# EAGLE design masterPuck (EAGLE 8.6.0)
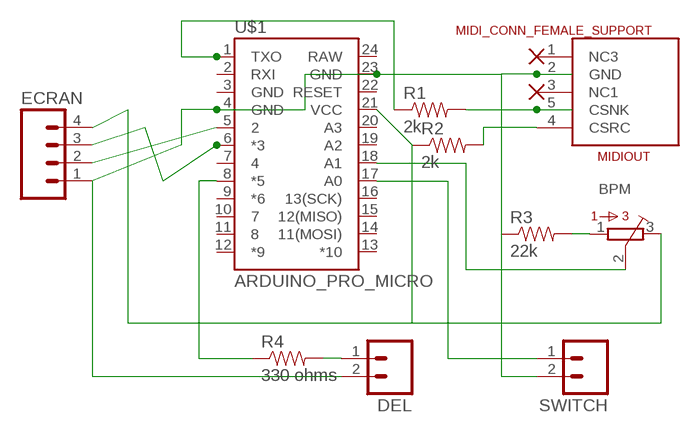
[diagram p0: schematic, sheet 1]

## Parts
BPM  3386-P  [3386P]
DEL  M02LOCK  [1X02_LOCK]
ECRAN  M04PTH  [1X04]
MIDIOUT  MIDI_CONN_FEMALE_SUPPORT  [DIN_5_FEMALE_SUPPORT]
R1  2k  RESISTOR1206  [1206]
R2  2k  RESISTOR1206  [1206]
R3  22k  RESISTOR1206  [1206]
R4  330 ohms  RESISTOR1206  [1206]
SWITCH  M02LOCK  [1X02_LOCK]
U$1  ARDUINO_PRO_MICRO  [ARDUINO_PRO_MICRO]

## Nets
GND: DEL.2 ECRAN.1 MIDIOUT.2(GND) R3.1 SWITCH.2 U$1.4(GND) U$1.23(GND)
N$2: MIDIOUT.5(CSNK) R1.2
N$3: MIDIOUT.4(CSRC) R2.2
N$5: R1.1 U$1.1(TXO)
N$7: ECRAN.2 U$1.5
N$8: ECRAN.3 U$1.6(*3)
N$9: BPM.1 R3.2
N$10: BPM.2 U$1.18(A1)
N$11: DEL.1 R4.2
N$12: R4.1 U$1.8(*5)
N$13: SWITCH.1 U$1.17(A0)
VCC: BPM.3 ECRAN.4 R2.1 U$1.21(VCC)
Unconnected: MIDIOUT.1(NC3) MIDIOUT.3(NC1) U$1.2(RXI) U$1.3(GND) U$1.7 U$1.9(*6) U$1.10 U$1.11 U$1.12(*9) U$1.13(*10) U$1.14(11(MOSI)) U$1.15(12(MISO)) U$1.16(13(SCK)) U$1.19(A2) U$1.20(A3) U$1.22(RESET) U$1.24(RAW)

## Library data of the parts
BPM = bourns.rpt:3386-: 3386 Series 3/8" Square Trimmer
DEL SWITCH = SparkFun-Connectors:M02: Standard 2-pin 0.1" header. Use with - straight break away headers ( PRT-00116) - right angle break away headers (PRT-00553) - swiss pins (PRT-00743) - machine pins (PRT-00117) - female headers (PRT-00115) Molex polarized connector foot print use with: PRT-08233 with associated crimp pins and housings. 2.54_SCREWTERM for use with PRT-10571. 3.5mm Screw Terminal footprints for PRT-08084 5mm Screw Terminal footprints for use with PRT-08432
ECRAN = SparkFun-Connectors:M04: Header 4 Standard 4-pin 0.1" header. Use with straight break away headers (SKU : PRT-00116), right angle break away headers (PRT-00553), swiss pins (PRT-00743), machine pins (PRT-00117), and female headers (PRT-00115). Molex polarized connector foot print use with SKU : PRT-08231 with associated crimp pins and housings. 1MM SMD Version SKU: PRT-10208
MIDIOUT = SparkFun-Connectors:MIDI_CONN_FEMALE_SUPPORT: MIDI connector with strain relief (DIN-5 female)
R1-R4 = SparkFun-Passives:RESISTOR: Resistor Basic schematic elements and footprints for 0603, 1206, and PTH resistors.
U$1 = SparkFun-Boards:ARDUINO_PRO_MICRO

## Board
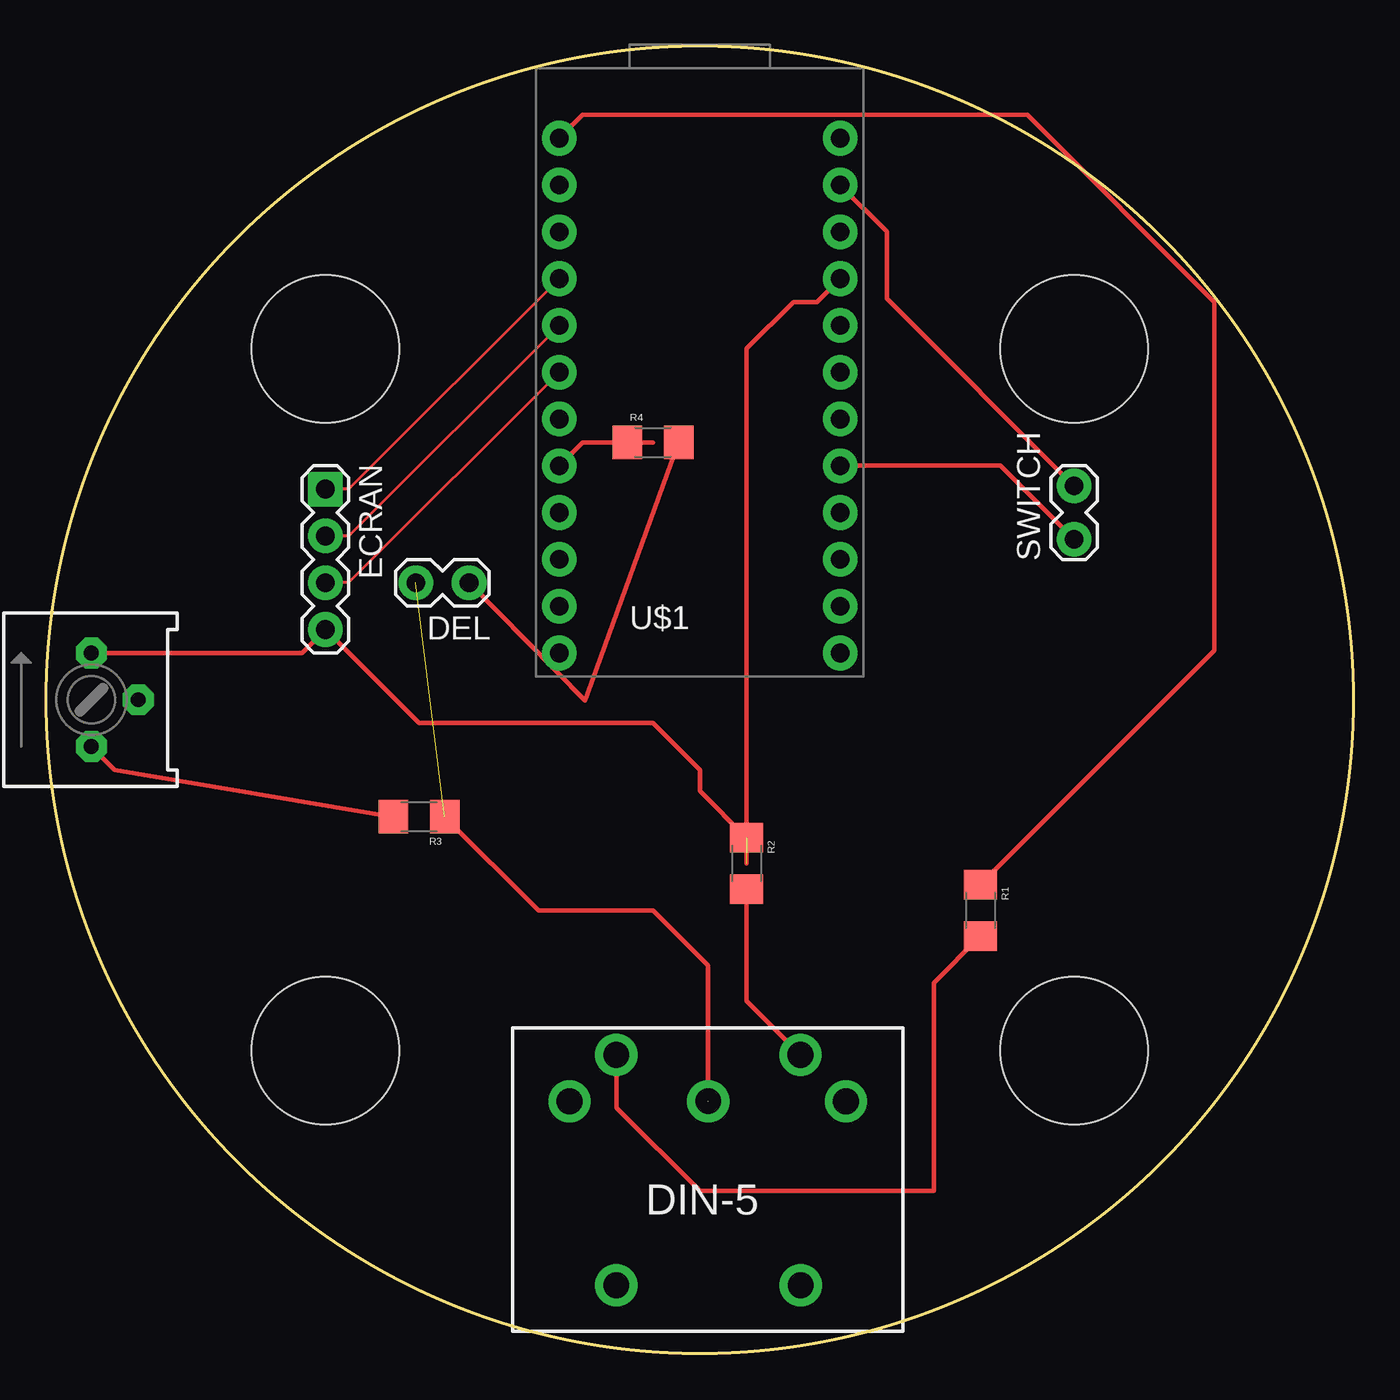
[diagram p1: board, top side]
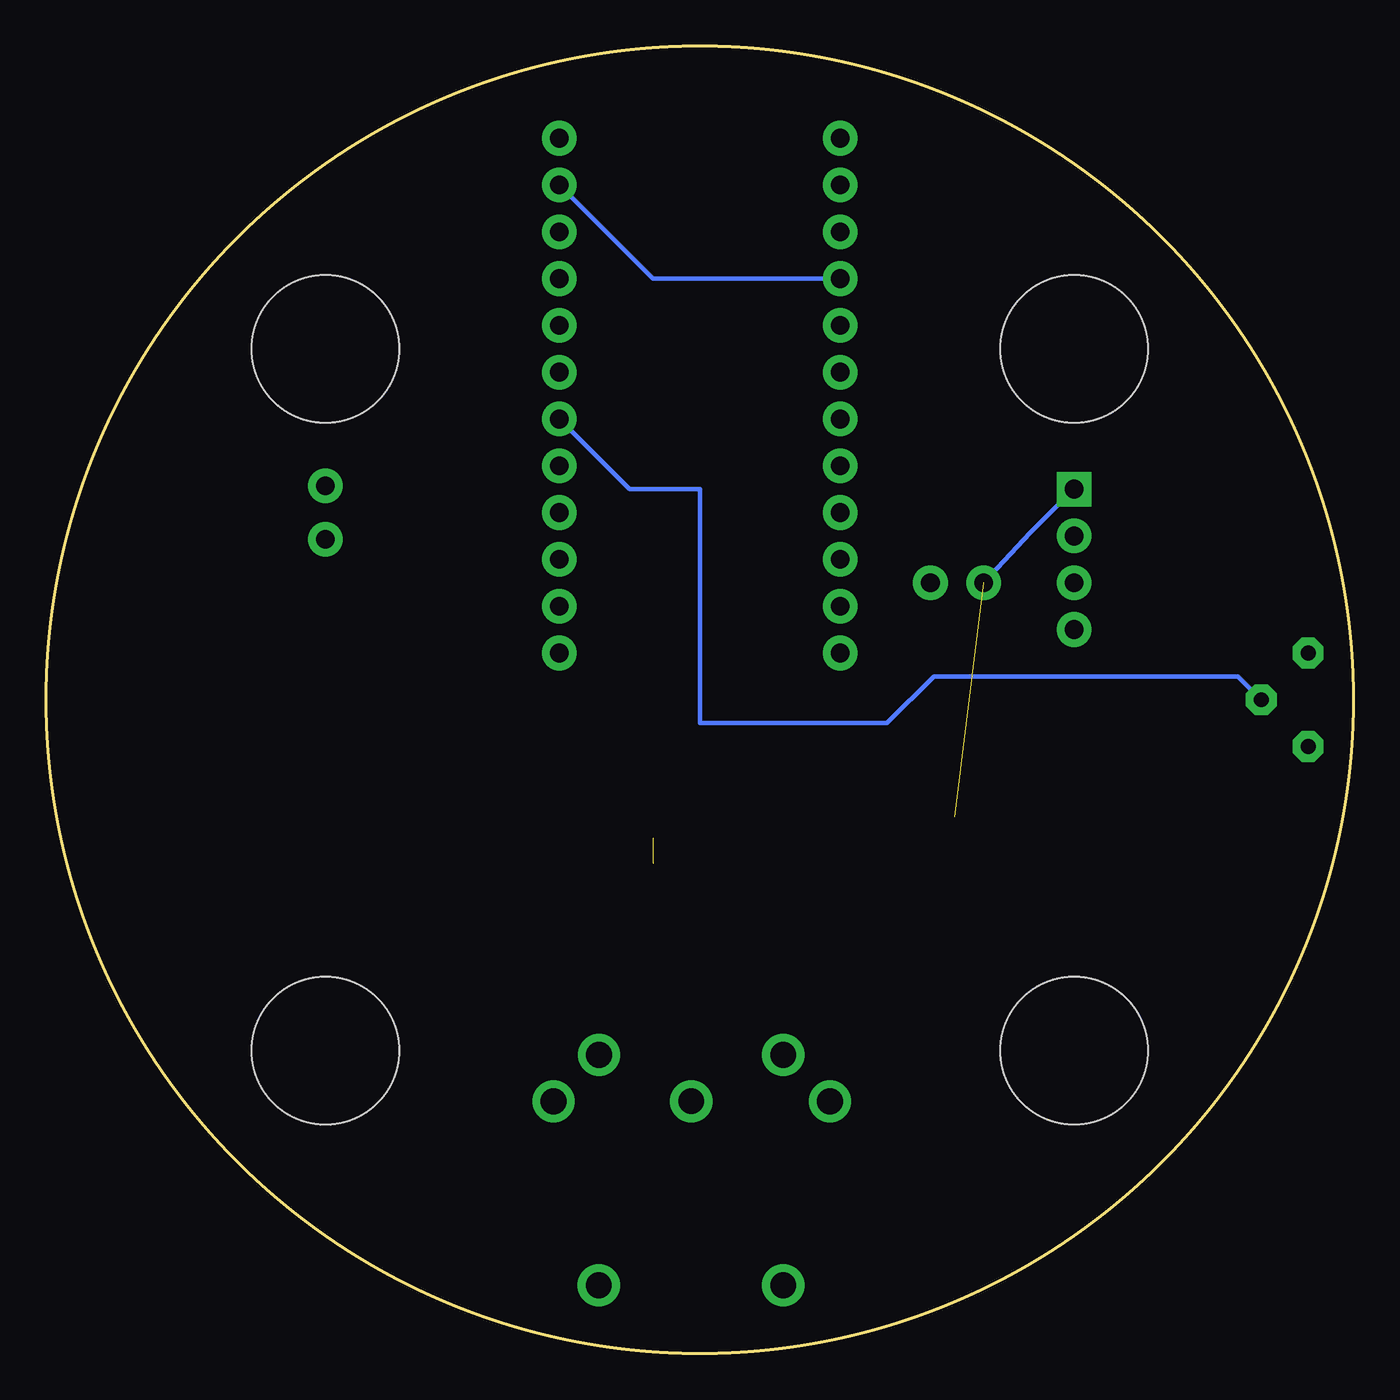
[diagram p2: board, bottom side, seen from below]

Size 70.97 x 70.97 mm. Coordinates in mm from the lower left corner, seen from the top.
Outline: circle at 35.48,35.48 radius 35.48
Copper layers (1*16): Top 0.035mm / dielectric 1.5mm / Bottom 0.035mm
Design rules "default": minimum track width 6mil, minimum drill 0.35mm, track to track 6mil, track to pad 6mil, pad to pad 6mil, via to via 6mil, smd to smd 6mil, copper to edge 40mil, drill to drill 6mil, minimum pad ring 10mil, minimum via ring 8mil, stop-mask expansion 4mil, vias tented up to drill 0mil, thermal gap 10mil
Holes 8 mm at 15.16,54.53 15.16,16.43 55.8,54.53 55.8,16.43

### Footprints (pad centres in the part's own frame; a part is rotated, then mirrored left to right if it is on the bottom)
3386P = drill 0.813 pad 1.676 octagon: 1 -2.54,0; 2 0,-2.54; 3 2.54,0
1X02_LOCK = drill 1.016 pad 1.88: 1 -0.178,0; 2 2.718,0
1X04 = drill 1.016 pad 1.88 square: 1 0,0 | drill 1.016 pad 1.88: 2 2.54,0; 3 5.08,0; 4 7.62,0
DIN_5_FEMALE_SUPPORT = drill 1.4 pad 2.286: 1 7.94,3.6; 2 0.46,3.61; 3 -7.07,3.6; 4 5.47,6.13; 5 -4.53,6.12; 6 -4.53,-6.382; 7 5.478,-6.382
1206 = smd 1.6 x 1.8: 1 -1.4,0; 2 1.4,0
ARDUINO_PRO_MICRO = drill 1.016 pad 1.88: 1 -7.62,12.7; 2 -7.62,10.16; 3 -7.62,7.62; 4 -7.62,5.08; 5 -7.62,2.54; 6 -7.62,0; 7 -7.62,-2.54; 8 -7.62,-5.08; 9 -7.62,-7.62; 10 -7.62,-10.16; 11 -7.62,-12.7; 12 -7.62,-15.24; 13 7.62,-15.24; 14 7.62,-12.7; 15 7.62,-10.16; 16 7.62,-7.62; 17 7.62,-5.08; 18 7.62,-2.54; 19 7.62,0; 20 7.62,2.54; 21 7.62,5.08; 22 7.62,7.62; 23 7.62,10.16; 24 7.62,12.7

### Placement (x,y rotation side)
BPM  2.46,35.48 90 top
DEL  22.78,41.83 180 top
ECRAN  15.16,46.91 270 top
MIDIOUT  35.48,10.08 0 top
R1  50.72,24.05 270 top
R2  38.02,26.59 270 top
R3  20.24,29.13 180 top
R4  32.94,49.45 0 top
SWITCH  55.8,44.37 90 top
U$1  35.48,53.26 0 top

### Tracks (layer width: path | path; a pad name or v marks a point on that pad's centre or on a via)
GND  (1 unrouted)
  Top 0.152: U$1.4 16.43,46.91 ECRAN.1
  Top 0.254: SWITCH.2 45.64,57.25 45.64,60.88 U$1.23 | R3.1 26.72,24.05 32.94,24.05 35.94,21.05 MIDIOUT.2
  Bottom 0.254: U$1.23 38.02,58.34 U$1.4 | DEL.2 17.53,44.55 ECRAN.1
N$2
  Top 0.254: MIDIOUT.5 30.95,13.34 35.48,8.81 48.18,8.81 48.18,20.11 R1.2
N$3
  Top 0.254: MIDIOUT.4 38.02,19.14 R2.2
N$5
  Top 0.254: U$1.1 29.13,67.23 53.26,67.23 63.42,57.07 63.42,38.15 R1.1
N$7
  Top 0.152: U$1.5 16.43,44.37 ECRAN.2
N$8
  Top 0.152: U$1.6 16.43,41.83 ECRAN.3
N$9
  Top 0.254: BPM.1 3.73,31.67 R3.2
N$10
  Bottom 0.254: U$1.18 39.29,46.91 35.48,46.91 35.48,34.21 25.32,34.21 22.78,36.75 6.27,36.75 BPM.2
N$11
  Top 0.254: DEL.1 29.26,35.44 R4.2
N$12
  Top 0.254: U$1.8 29.13,49.45 R4.1 32.94,49.45
N$13
  Top 0.254: SWITCH.1 51.82,48.18 U$1.17
VCC  (1 unrouted)
  Top 0.254: U$1.21 41.83,57.07 40.56,57.07 38.02,54.53 38.02,26.59 | R2.1 35.48,30.53 35.48,31.67 32.94,34.21 20.24,34.21 ECRAN.4 13.89,38.02 BPM.3